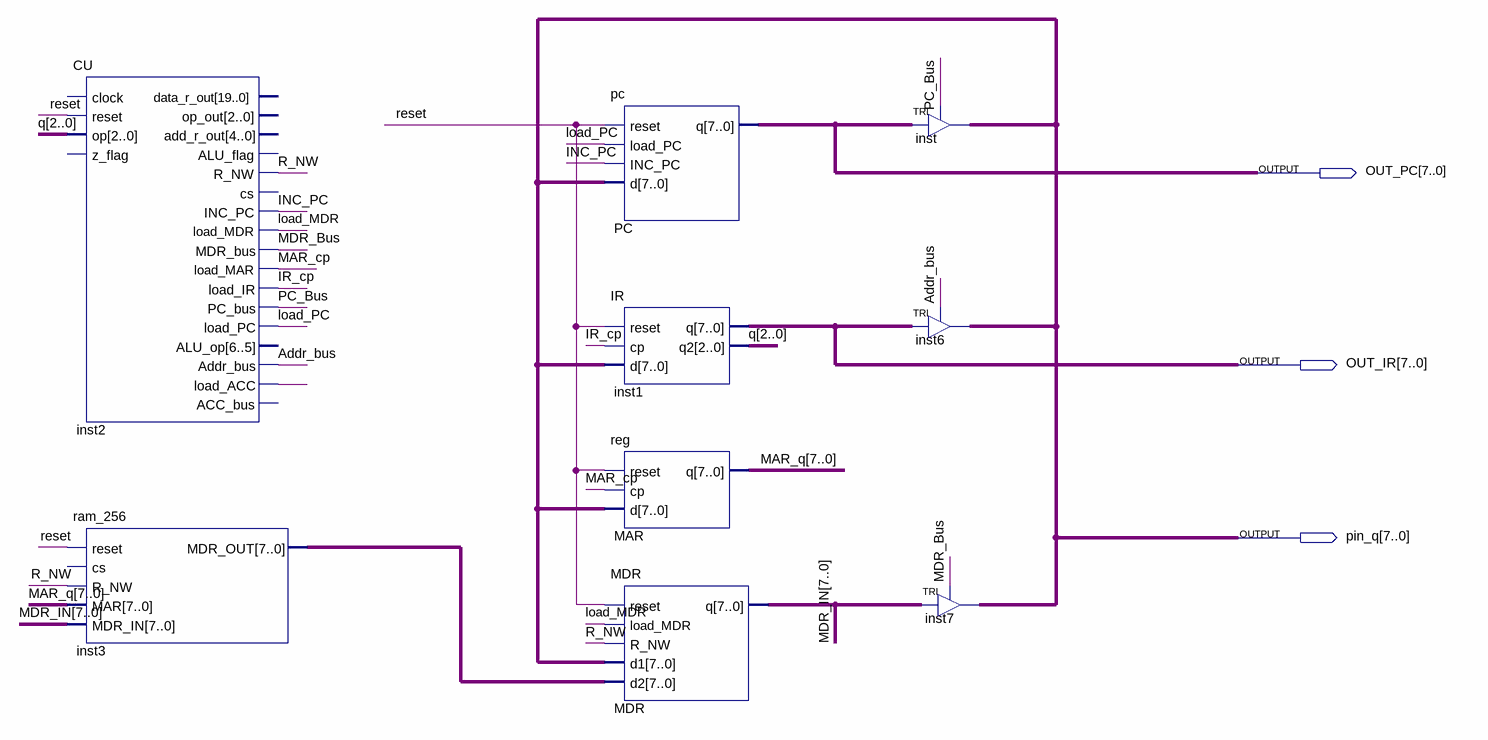
[diagram p0: schematic sheet]
// Quartus schematic regs.bdf as structural Verilog: 9 symbols, 3 pins
module regs (
  output [7:0] OUT_PC,
  output [7:0] OUT_IR,
  output [7:0] pin_q
);

  wire Addr_bus, INC_PC, inst2_load_acc, IR_cp, load_MDR, load_PC, MAR_cp, MDR_Bus, PC_Bus, R_NW, reset;
  wire [2:0] q;
  wire [7:0] inst3_mdr_out, MAR_q, MDR_IN;

  CU inst2 (
    .reset(reset), .op(q), .R_NW(R_NW), .INC_PC(INC_PC), .load_MDR(load_MDR), .MDR_bus(MDR_Bus),
    .load_MAR(MAR_cp), .load_IR(IR_cp), .PC_bus(PC_Bus), .load_PC(load_PC), .Addr_bus(Addr_bus),
    .load_ACC(inst2_load_acc));  // open: clock, z_flag, op_out, add_r_out, ALU_flag, cs, ALU_op, ACC_bus, data_r_out
  ram_256 inst3 (.reset(reset), .R_NW(R_NW), .MAR(MAR_q), .MDR_IN(MDR_IN), .MDR_OUT(inst3_mdr_out));  // open: cs
  pc PC (.reset(reset), .load_PC(load_PC), .INC_PC(INC_PC), .d(pin_q), .q(OUT_PC));
  IR inst1 (.reset(reset), .cp(IR_cp), .d(pin_q), .q(OUT_IR), .q2(q));
  \reg  MAR (.reset(reset), .cp(MAR_cp), .d(pin_q), .q(MAR_q));
  MDR MDR (.reset(reset), .load_MDR(load_MDR), .R_NW(R_NW), .d1(pin_q), .d2(inst3_mdr_out), .q(MDR_IN));
  TRI inst[7:0] (.IN(OUT_PC), .OE(PC_Bus), .OUT(pin_q));
  TRI inst6[7:0] (.IN(OUT_IR), .OE(Addr_bus), .OUT(pin_q));
  TRI inst7[7:0] (.IN(MDR_IN), .OE(MDR_Bus), .OUT(pin_q));
endmodule
